# EAGLE design Mabee_Relay_10A V1.1 (EAGLE 6.1)
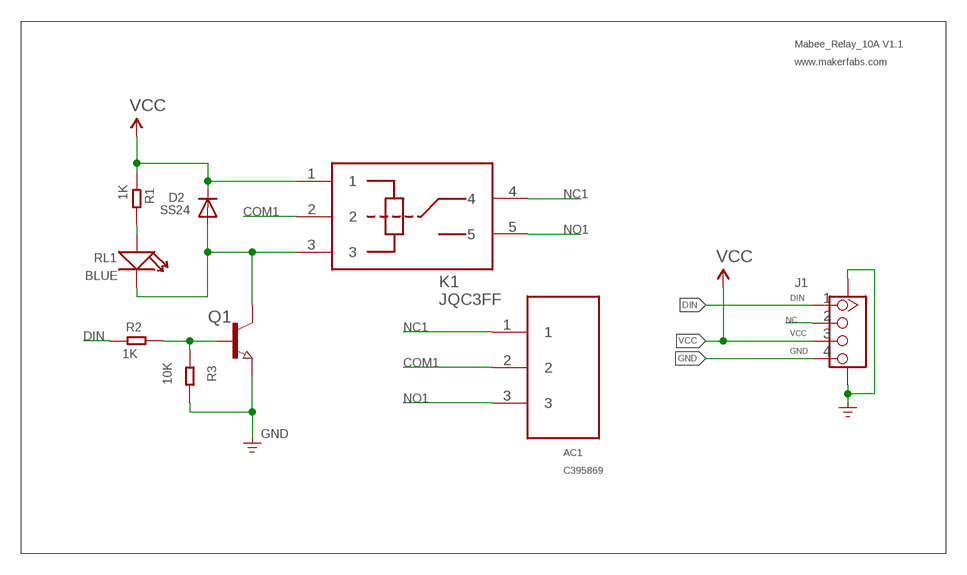
[diagram p0: schematic, sheet 1]

## Parts
AC1  C395869  [PIN_3P]
D2  SS24  DIODESMA  [SMADIODE]
J1  GROVE-CONNECTOR-SMD'90D'  [HW4-SMD-2.0-90D]
K1  JQC3FF  [DIP5_JQC3FF]
Q1  NPN-TRANSISTOR_SOT23  [SOT23]
R1  1K  R-0603  [R0603]
R2  1K  R-0603  [R0603]
R3  10K  R-0603  [R0603]
RL1  BLUE  LED'0603'  [LED-0603]

## Nets
COM1: AC1.2 K1.2
DIN: J1.1 R2.1
GND: J1.4 J1.SS1 J1.SS2 Q1.2(E) R3.2
N$3: R1.2 RL1.+
N$9: D2.A K1.3 Q1.3(C) RL1.-
N$14: Q1.1(B) R2.2 R3.1
NC: J1.2
NC1: AC1.1 K1.4
NO1: AC1.3 K1.5
VCC: D2.C J1.3 K1.1 R1.1

## Notes on the sheet
- Mabee_Relay_10A V1.1
- www.makerfabs.com

## Library data of the parts
AC1 = 1mytest:C395869
D2 = adafruit:DIODE: Diode SMADIODE - SMA Surface Mount Package 20V 1A Schottky Diode Digikey: 641-1014-6-ND DO-1N4148 - Through Hole Small Current Diode SOD-123 20V 1 A (.5mV Vf) Schottky Diode - Digikey: MBRX120TPMSCT-ND SOD-323 10V 570mA (.38mV Vf, 3ns) Schottky Diode - Digikey: ZLLS410CT-ND SOD-523 30V 30mA Schottky Diode (RB751S-40TE61) - Digikey: RB751S-40TE61CT-ND SOT23-R/W - SOT23 Package (R = Solder Paste/Reflow Ovens, W = Hand-Soldering) BAT54Film 40V 300mA - Digikey: 497-7162-1-ND
J1 = Connector-new:GROVE-CONNECTOR-SMD: 4P-SMD-2.0:320110030;4P-SMD-2.0-90D:320110032
K1 = 1mytest:JQC3FF
Q1 = semicon-smd-ipc:NPN-TRANSISTOR_: NPN TRANSISTOR
R1-R3 = Discrete:R*
RL1 = Discrete:LED*

## Net classes
0 default: width 0.152 mm, drill 0.305 mm, clearance 0.152 mm

## Board
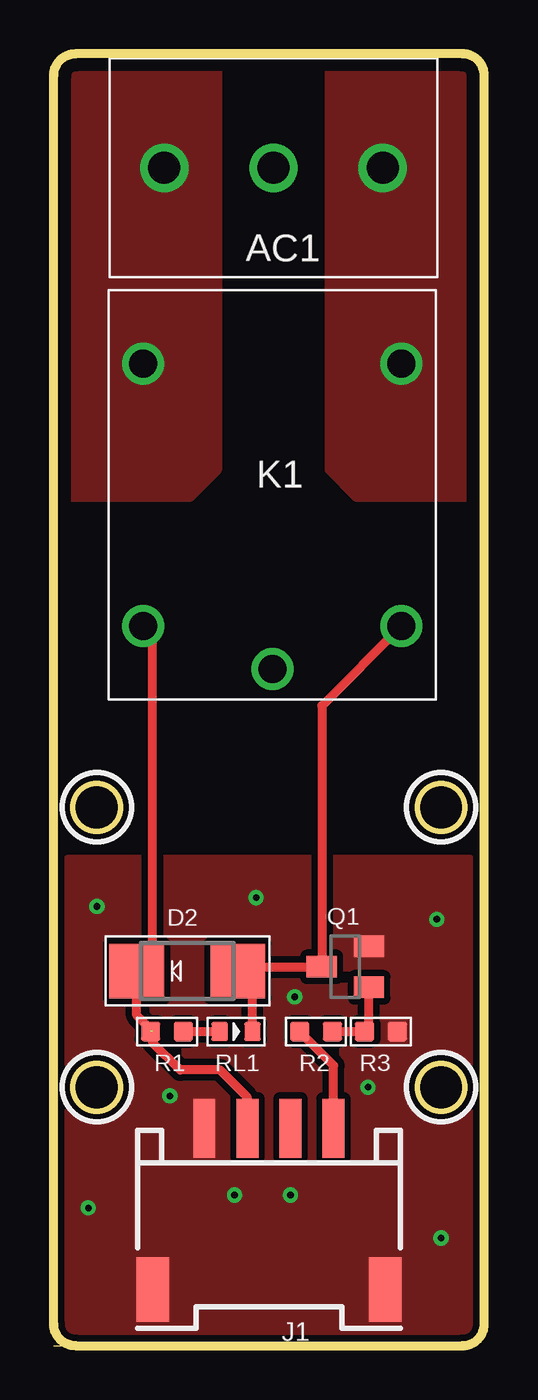
[diagram p1: board, top side]
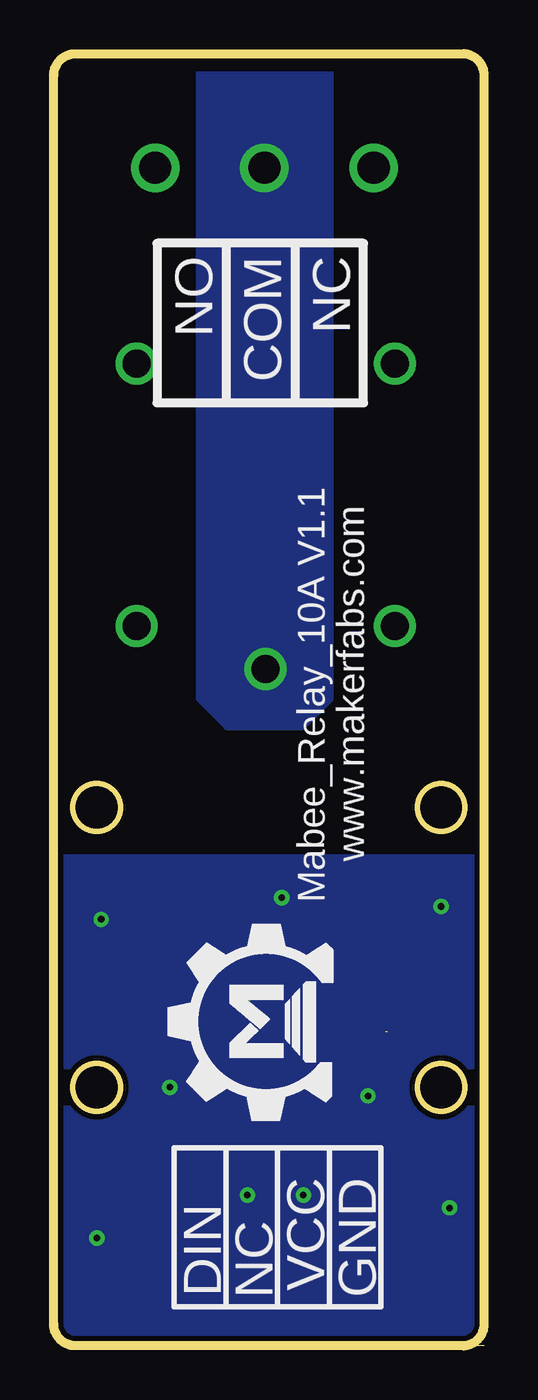
[diagram p2: board, bottom side, seen from below]

Size 20 x 60 mm. Coordinates in mm from the lower left corner, seen from the top.
Outline: 0,0 1,0
Outline: 1,0 19,0 arc90 20,1 20,59 arc90 19,60 1,60 arc90 0,59 0,1 arc90 1,0
Outline: circle at 2,12 radius 1.1
Outline: circle at 18,12 radius 1.1
Outline: circle at 2,25 radius 1.1
Outline: circle at 18,25 radius 1.1
Copper layers (1*16): Top 0.035mm / dielectric 1.5mm / Bottom 0.035mm
Design rules: minimum track width 10mil, minimum drill 24mil, track to track 8mil, track to pad 8mil, pad to pad 8mil, via to via 8mil, smd to smd 8mil, copper to edge 10mil, drill to drill 8mil, minimum pad ring 10mil, minimum via ring 8mil, stop-mask expansion 4mil, vias tented up to drill 0mil, thermal gap 0mil

### Footprints (pad centres in the part's own frame; a part is rotated, then mirrored left to right if it is on the bottom)
PIN_3P = drill 1.5: 1 0,10.16; 2 0,5.08; 3 0,0
SMADIODE = smd 2.54 x 2.54: A 2.349,0; C -2.349,0
HW4-SMD-2.0-90D = smd 1.01 x 2.74: 1 -3,-0.1; 2 -1,-0.1; 3 1,-0.1; 4 3,-0.1 | smd 1.5 x 3: SS1 -5.4,7.4; SS2 5.4,7.4
DIP5_JQC3FF = drill 1.3: 1 0,12; 2 -2,6; 3 0,0; 4 12.2,12; 5 12.2,0
SOT23 = smd 1 x 1.4: 1 -0.95,-1.1; 2 0.95,-1.1; 3 0,1.1
R0603 = smd 0.889 x 0.889: 1 -0.762,0; 2 0.762,0
LED-0603 = smd 0.762 x 0.889: + -0.762,0; - 0.762,0

### Placement (x,y rotation side)
AC1  15.29,54.71 90 top
D2  6.2,17.4 0 top
J1  10,10 180 top
K1  16.16,33.42 90 top
Q1  13.55,17.6 90 top
R1  5.26,14.59 0 top
R2  12.19,14.59 0 top
R3  15.2,14.59 0 top
RL1  8.47,14.59 0 top
U$2  [MAKERFABS_0.3]  7.07,10.93 90 bottom

### Tracks (layer width: path | path; a pad name or v marks a point on that pad's centre or on a via)
COM1
  pour Bottom (isolate 0.61, no thermals): 7.2,30.07 7.2,59.93 8.47,61.2 11.93,61.2 13.2,59.93 13.2,30.07 11.93,28.8 8.47,28.8
DIN
  Top 0.406: J1.1 13,13.02 R2.1
GND  (via drill 0.3)
  other vias: 2,20.4 9.4,20.8 17.8,19.8 5.4,11.6 1.6,6.4 11,7 8.4,7 18,5 14.6,12 11.2,16.2
  pour Bottom (isolate 0.254, rank 4): -1.2,15.2 -1.2,21.33 0.07,22.6 8.6,22.6 19.73,22.6 21,21.33 21,17 21,0.47 19.73,-0.8 10.4,-0.8 0.07,-0.8 -1.2,0.47
  pour Top (isolate 0.305, rank 4, no thermals): -0.6,11.6 -0.6,21.33 0.67,22.6 10.6,22.6 19.33,22.6 20.6,21.33 20.6,19.2 20.6,0.47 19.33,-0.8 9.4,-0.8 0.67,-0.8 -0.6,0.47
N$3
  Top 0.406: R1.2 RL1.+
N$9
  Top 0.406: 8.83,17.12 D2.A | D2.A 8.75,17.6 Q1.3 12.45,29.71 K1.3 | RL1.- 9.23,16.72 D2.A
N$14
  Top 0.406: R2.2 R3.1 14.65,14.8 Q1.1 arc-90 14.84,16.46
NC1
  pour Top (isolate 0.61, no thermals): -1.6,46.4 -1.6,59.73 -0.33,61 3.4,61 6.33,61 7.6,59.73 7.6,54.2 7.6,40.67 6.33,39.4 4,39.4 -0.33,39.4 -1.6,40.67
NO1
  pour Top (isolate 0.61, no thermals): 12.8,54.8 12.8,59.73 14.07,61 15.8,61 19.93,61 21.2,59.73 21.2,52.2 21.2,40.67 19.93,39.4 16,39.4 14.07,39.4 12.8,40.67
VCC  (1 unrouted)
  Top 0.406: J1.3 9,11.53 7.73,12.8 5.87,12.8 4.6,14.07 4.6,14.6 3.85,15.35 D2.C 4.6,18.15 4.6,32.98 K1.1

### Text on the board
bPlace: www.makerfabs.com | Mabee_Relay_10A V1.1
bNames: NC | COM | NO | GND | VCC | DIN | NC